# Altium project PCB_Project.PrjPcb
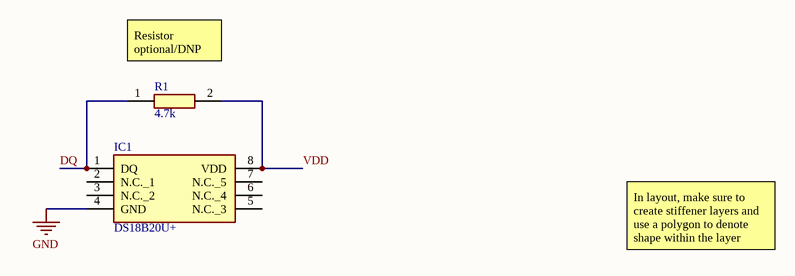
[diagram p0: Temp_Sensor.SchDoc]
1 sheet, 2 parts. Net scope: global (net labels, ports and power ports of the same name join across sheets).
Board file: Temperature_Flex_REV1.PcbDoc

## Sheet Temp_Sensor.SchDoc
size A; SheetNumber: 1; SheetTotal: 1

### Parts
IC1  DS18B20U+  [SOP65P490X110-8N]
R1  4.7k  [RESC1608X50N]

### Nets
GND: IC1.4(GND)
DQ: IC1.1(DQ) R1.1
VDD: IC1.8(VDD) R1.2

Not connected (* = marked no-connect by the designer): IC1 2(N.C._1) 3(N.C._2) 5(N.C._3) 6(N.C._4) 7(N.C._5)

### Notes on the sheet
- (near R1) Resistor optional/DNP
- In layout, make sure to create stiffener layers and use a polygon to denote shape within the layer

### Library data of the parts
IC1 = DS18B20U+: Integrated Circuit; Manufacturer_Name: Analog Devices; Datasheet Link: https://datasheets.maximintegrated.com/en/ds/DS18B20.pdf; Height: 1.1mm; Manufacturer_Part_Number: DS18B20U+; Mouser Part Number: 700-DS18B20U; Mouser Price/Stock: https://www.mouser.co.uk/ProductDetail/Analog-Devices-Maxim-Integrated/DS18B20U%2b?qs=7H2Jq%252ByxpJLxAEcPXZtrFQ%3D%3D; Arrow Part Number: DS18B20U+; Arrow Price/Stock: https://www.arrow.com/en/products/ds18b20u/analog-devices?utm_currency=USD&region=nac
R1 = CRCW06034K70FKEAHP: Resistor; Manufacturer_Name: Vishay; Datasheet Link: http://www.farnell.com/datasheets/1885357.pdf; Height: 0.5mm; Manufacturer_Part_Number: CRCW06034K70FKEAHP; Mouser Part Number: 71-CRCW06034K70FKEAH; Mouser Price/Stock: https://www.mouser.co.uk/ProductDetail/Vishay-Dale/CRCW06034K70FKEAHP?qs=k2%2FDWSARqgF9tclCHvhGkQ%3D%3D; Arrow Part Number: CRCW06034K70FKEAHP; Arrow Price/Stock: https://www.arrow.com/en/products/crcw06034k70fkeahp/vishay?utm_currency=USD&region=nac